# EAGLE design 1.0 - First design (EAGLE 6.4)
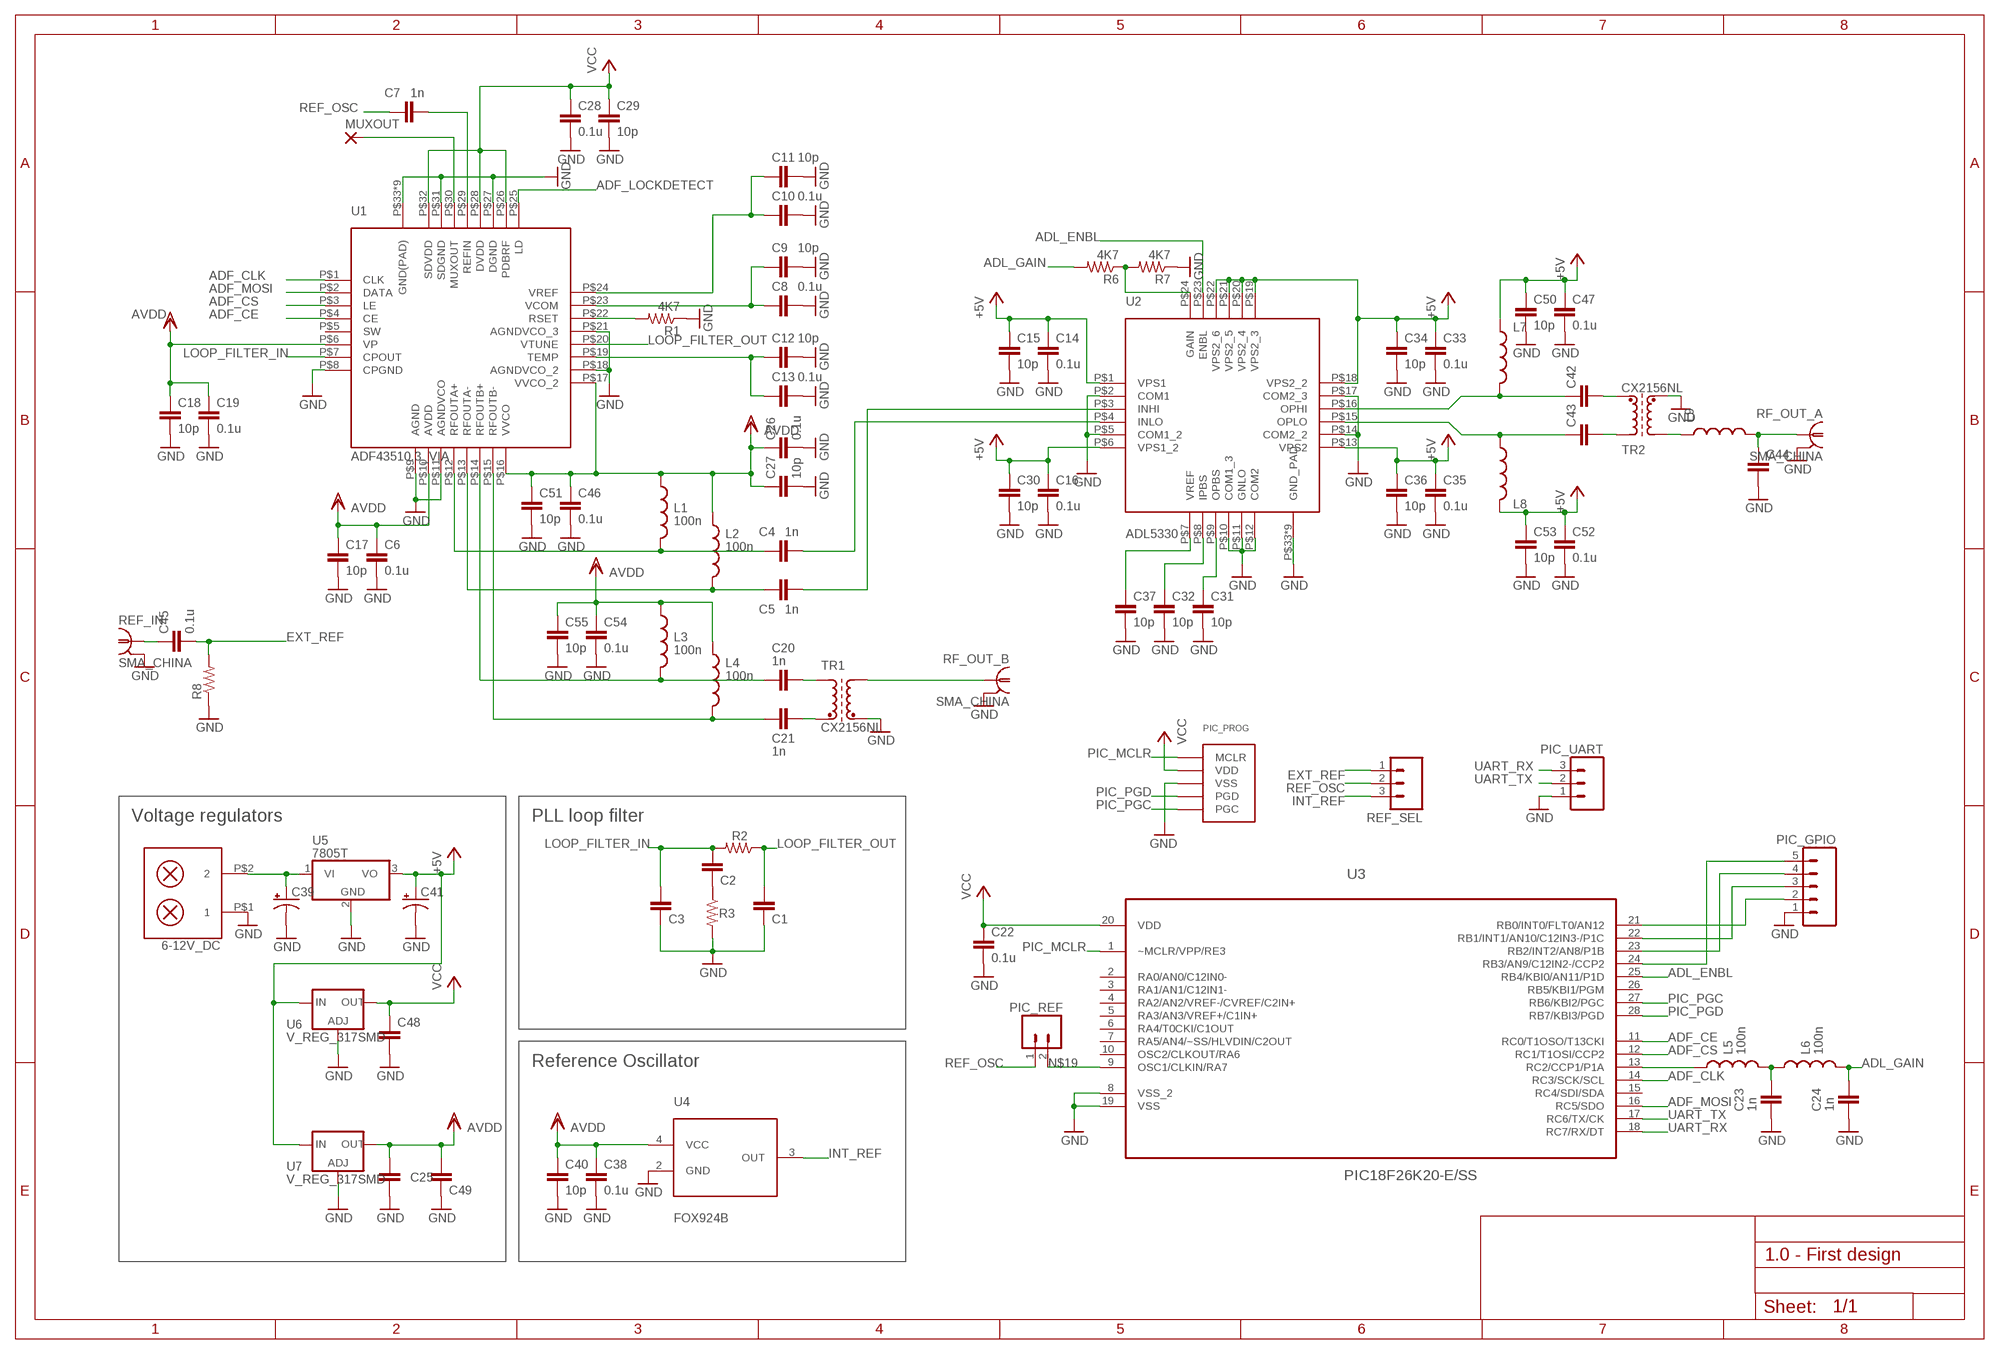
[diagram p0: schematic, sheet 1]

## Parts
6-12V_DC  PK5602  [PK5602]
C1  CAP0603-CAP  [0603-CAP]
C2  CAP0603-CAP  [0603-CAP]
C3  CAP0603-CAP  [0603-CAP]
C4  1n  CAP0603-CAP  [0603-CAP]
C5  1n  CAP0603-CAP  [0603-CAP]
C6  0.1u  CAP0603-CAP  [0603-CAP]
C7  1n  CAP0603-CAP  [0603-CAP]
C8  0.1u  CAP0603-CAP  [0603-CAP]
C9  10p  CAP0603-CAP  [0603-CAP]
C10  0.1u  CAP0603-CAP  [0603-CAP]
C11  10p  CAP0603-CAP  [0603-CAP]
C12  10p  CAP0603-CAP  [0603-CAP]
C13  0.1u  CAP0603-CAP  [0603-CAP]
C14  0.1u  CAP0603-CAP  [0603-CAP]
C15  10p  CAP0603-CAP  [0603-CAP]
C16  0.1u  CAP0603-CAP  [0603-CAP]
C17  10p  CAP0603-CAP  [0603-CAP]
C18  10p  CAP0603-CAP  [0603-CAP]
C19  0.1u  CAP0603-CAP  [0603-CAP]
C20  1n  CAP0603-CAP  [0603-CAP]
C21  1n  CAP0603-CAP  [0603-CAP]
C22  0.1u  CAP0603-CAP  [0603-CAP]
C23  1n  CAP0603-CAP  [0603-CAP]
C24  1n  CAP0603-CAP  [0603-CAP]
C25  C-EUC0805  [C0805]
C26  0.1u  CAP0603-CAP  [0603-CAP]
C27  10p  CAP0603-CAP  [0603-CAP]
C28  0.1u  CAP0603-CAP  [0603-CAP]
C29  10p  CAP0603-CAP  [0603-CAP]
C30  10p  CAP0603-CAP  [0603-CAP]
C31  10p  CAP0603-CAP  [0603-CAP]
C32  10p  CAP0603-CAP  [0603-CAP]
C33  0.1u  CAP0603-CAP  [0603-CAP]
C34  10p  CAP0603-CAP  [0603-CAP]
C35  0.1u  CAP0603-CAP  [0603-CAP]
C36  10p  CAP0603-CAP  [0603-CAP]
C37  10p  CAP0603-CAP  [0603-CAP]
C38  0.1u  CAP0603-CAP  [0603-CAP]
C39  CAP_POLSMD  [VISHAY_C]
C40  10p  CAP0603-CAP  [0603-CAP]
C41  CAP_POLSMD  [VISHAY_C]
C42  CAP  [C0805K]
C43  CAP  [C0805K]
C44  CAP  [C0805K]
C45  0.1u  CAP0603-CAP  [0603-CAP]
C46  0.1u  CAP0603-CAP  [0603-CAP]
C47  0.1u  CAP0603-CAP  [0603-CAP]
C48  C-EUC0805  [C0805]
C49  C-EUC0805  [C0805]
C50  10p  CAP0603-CAP  [0603-CAP]
C51  10p  CAP0603-CAP  [0603-CAP]
C52  0.1u  CAP0603-CAP  [0603-CAP]
C53  10p  CAP0603-CAP  [0603-CAP]
C54  0.1u  CAP0603-CAP  [0603-CAP]
C55  10p  CAP0603-CAP  [0603-CAP]
L1  100n  INDUCTOR0603  [0603]
L2  100n  INDUCTOR0603  [0603]
L3  100n  INDUCTOR0603  [0603]
L4  100n  INDUCTOR0603  [0603]
L5  100n  INDUCTOR0603  [0603]
L6  100n  INDUCTOR0603  [0603]
L7  INDUCTOR  [C0805K]
L8  INDUCTOR  [C0805K]
L9  INDUCTOR  [C0805K]
MUXOUT  SMD2  [SMD1,27-2,54]
PIC_GPIO  M05PTH  [1X05]
PIC_PROG  1X5_ICSP  [1X5_2MM]
PIC_REF  M02PTH  [1X02]
PIC_UART  M03PTH  [1X03]
R1  4K7  RESISTOR0603-RES  [0603-RES]
R2  RESISTOR0603-RES  [0603-RES]
R3  RESISTOR0603-RES  [0603-RES]
R6  4K7  RESISTOR0603-RES  [0603-RES]
R7  4K7  RESISTOR0603-RES  [0603-RES]
R8  RESISTOR  [C0805K]
REF_IN  SMA_CHINA  [SMA-EDGE]
REF_SEL  M03PTH  [1X03]
RF_OUT_A  SMA_CHINA  [SMA-EDGE]
RF_OUT_B  SMA_CHINA  [SMA-EDGE]
TR1  CX2156NL  [CX2156NL]
TR2  CX2156NL  [CX2156NL]
U1  ADF43510.3_VIA  [LFCSP_CP-32-2_.3VIA]
U2  ADL5330  [LFCSP_CP-24-2_.3VIA]
U3  PIC18F26K20-E/SS  [SOP65P780X200-28N]
U4  FOX924B  [FOX924B]
U5  7805T  [TO220H]
U6  V_REG_317SMD  [SOT223]
U7  V_REG_317SMD  [SOT223]

## Nets
+5V: C14.1 C15.1 C16.1 C30.1 C33.1 C34.1 C35.1 C36.1 C41.+ C47.1 C50.1 C52.1 C53.1 L7.1 L8.1 U2.P$1(VPS1) U2.P$6(VPS1_2) U2.P$13(VPS2) U2.P$18(VPS2_2) U2.P$19(VPS2_3) U2.P$20(VPS2_4) U2.P$21(VPS2_5) U2.P$22(VPS2_6) U5.3(VO) U6.3(IN) U7.3(IN)
ADF_CE: U1.P$4(CE) U3.11(RC0/T1OSO/T13CKI)
ADF_CLK: U1.P$1(CLK) U3.14(RC3/SCK/SCL)
ADF_CS: U1.P$3(LE) U3.12(RC1/T1OSI/CCP2)
ADF_LOCKDETECT: U1.P$25(LD)
ADF_MOSI: U1.P$2(DATA) U3.16(RC5/SDO)
ADF_MUXOUT: MUXOUT.1(P) U1.P$30(MUXOUT)
ADL_ENBL: U2.P$23(ENBL) U3.25(RB4/KBI0/AN11/P1D)
ADL_GAIN: C24.2 L6.2 R6.2
EXT_REF: C45.2 R8.2 REF_SEL.1
GND: 6-12V_DC.P$1 C1.2 C3.2 C6.2 C8.2 C9.2 C10.2 C11.2 C12.2 C13.2 C14.2 C15.2 C16.2 C17.2 C18.2 C19.2 C22.2 C23.1 C24.1 C25.2 C26.2 C27.2 C28.2 C29.2 C30.2 C31.2 C32.2 C33.2 C34.2 C35.2 C36.2 C37.2 C38.2 C39.- C40.2 C41.- C44.2 C46.2 C47.2 C48.2 C49.2 C50.2 C51.2 C52.2 C53.2 C54.2 C55.2 PIC_GPIO.1 PIC_PROG.P$3(VSS) PIC_UART.1 R1.1 R3.2 R7.1 R8.1 REF_IN.GND@0(GND) REF_IN.GND@1(GND) REF_IN.GND@2(GND) REF_IN.GND@3(GND) RF_OUT_A.GND@0(GND) RF_OUT_A.GND@1(GND) RF_OUT_A.GND@2(GND) RF_OUT_A.GND@3(GND) RF_OUT_B.GND@0(GND) RF_OUT_B.GND@1(GND) RF_OUT_B.GND@2(GND) RF_OUT_B.GND@3(GND) TR1.5(E2) TR2.5(E2) U1.P$8(CPGND) U1.P$9(AGND) U1.P$11(AGNDVCO) U1.P$18(AGNDVCO_2) U1.P$21(AGNDVCO_3) U1.P$27(DGND) U1.P$31(SDGND) U1.P$33(GND(PAD)) U1.P$34(GND(PAD)) U1.P$35(GND(PAD)) U1.P$36(GND(PAD)) U1.P$37(GND(PAD)) U1.P$38(GND(PAD)) U1.P$39(GND(PAD)) U1.P$40(GND(PAD)) U1.P$41(GND(PAD)) U2.P$2(COM1) U2.P$5(COM1_2) U2.P$10(COM1_3) U2.P$11(GNLO) U2.P$12(COM2) U2.P$14(COM2_2) U2.P$17(COM2_3) U2.P$33(GND_PAD) U2.P$34(GND_PAD) U2.P$35(GND_PAD) U2.P$36(GND_PAD) U2.P$37(GND_PAD) U2.P$38(GND_PAD) U2.P$39(GND_PAD) U2.P$40(GND_PAD) U2.P$41(GND_PAD) U3.8(VSS_2) U3.19(VSS) U4.2(GND) U5.2(GND) U6.1(ADJ) U7.1(ADJ)
INT_REF: REF_SEL.3 U4.3(OUT)
LOOP_FILTER_IN: C2.1 C3.1 R2.2 U1.P$7(CPOUT)
LOOP_FILTER_OUT: C1.1 R2.1 U1.P$20(VTUNE)
N$1: C5.2 U2.P$3(INHI)
N$2: C4.2 U2.P$4(INLO)
N$3: C7.2 U1.P$29(REFIN)
N$4: L9.1 TR2.4(A2)
N$5: C42.1 L7.2 U2.P$16(OPHI)
N$6: R1.2 U1.P$22(RSET)
N$7: C43.1 L8.2 U2.P$15(OPLO)
N$8: C2.2 R3.1
N$9: C5.1 L2.2 U1.P$13(RFOUTA-)
N$10: C4.1 L1.2 U1.P$12(RFOUTA+)
N$11: 6-12V_DC.P$2 C39.+ U5.1(VI)
N$12: C43.2 TR2.3(A1)
N$13: C12.1 C13.1 U1.P$19(TEMP)
N$14: C8.1 C9.1 U1.P$23(VCOM)
N$15: PIC_GPIO.5 U3.24(RB3/AN9/C12IN2-/CCP2)
N$16: C42.2 TR2.1(E1)
N$17: PIC_GPIO.4 U3.23(RB2/INT2/AN8/P1B)
N$18: C20.1 L3.2 U1.P$14(RFOUTB+)
N$19: PIC_REF.2 U3.9(OSC1/CLKIN/RA7)
N$20: C10.1 C11.1 U1.P$24(VREF)
N$21: C21.1 L4.2 U1.P$15(RFOUTB-)
N$22: L5.1 U3.13(RC2/CCP1/P1A)
N$23: C21.2 TR1.1(E1)
N$24: C23.2 L5.2 L6.1
N$25: C20.2 TR1.3(A1)
N$26: RF_OUT_B.SIG TR1.4(A2)
N$27: C37.1 U2.P$7(VREF)
N$28: PIC_GPIO.3 U3.22(RB1/INT1/AN10/C12IN3-/P1C)
N$29: PIC_GPIO.2 U3.21(RB0/INT0/FLT0/AN12)
N$31: R6.1 R7.2 U2.P$24(GAIN)
N$32: C45.1 REF_IN.SIG
N$37: C31.1 U2.P$9(OPBS)
N$38: C32.1 U2.P$8(IPBS)
N$40: C44.1 L9.2 RF_OUT_A.SIG
PIC_MCLR: PIC_PROG.P$1(MCLR) U3.1(~MCLR/VPP/RE3)
PIC_PGC: PIC_PROG.P$5(PGC) U3.27(RB6/KBI2/PGC)
PIC_PGD: PIC_PROG.P$4(PGD) U3.28(RB7/KBI3/PGD)
REF_OSC: C7.1 PIC_REF.1 REF_SEL.2
UART_RX: PIC_UART.3 U3.18(RC7/RX/DT)
UART_TX: PIC_UART.2 U3.17(RC6/TX/CK)
VCC: C22.1 C28.1 C29.1 C48.1 PIC_PROG.P$2(VDD) U1.P$26(PDBRF) U1.P$28(DVDD) U1.P$32(SDVDD) U3.20(VDD) U6.2(OUT)
VDD: C6.1 C17.1 C18.1 C19.1 C25.1 C26.1 C27.1 C38.1 C40.1 C46.1 C49.1 C51.1 C54.1 C55.1 L1.1 L2.1 L3.1 L4.1 U1.P$6(VP) U1.P$10(AVDD) U1.P$16(VVCO) U1.P$17(VVCO_2) U4.4(VCC) U7.2(OUT) ; supply symbol labelled AVDD
Unconnected: U1.P$5(SW) U3.2(RA0/AN0/C12IN0-) U3.3(RA1/AN1/C12IN1-) U3.4(RA2/AN2/VREF-/CVREF/C2IN+) U3.5(RA3/AN3/VREF+/C1IN+) U3.6(RA4/T0CKI/C1OUT) U3.7(RA5/AN4/~SS/HLVDIN/C2OUT) U3.10(OSC2/CLKOUT/RA6) U3.15(RC4/SDI/SDA) U3.26(RB5/KBI1/PGM)

## Notes on the sheet
- Voltage regulators | PLL loop filter
- Reference Oscillator

## Library data of the parts
6-12V_DC = 08-maritime-components:PK5602: Screw terminal from Hartmann ELFA: https://www.elfaelektronikk.no/elfa3~no_no/elfa/init.do?item=48-335-80&toc=19604
C1-C24 C26-C38 C40 C45-C47 C50-C55 = SparkFun:CAP: Capacitor Standard 0603 ceramic capacitor, and 0.1" leaded capacitor.
C25 C48 C49 = rcl:C-EU: CAPACITOR, European symbol
C39 C41 = SparkFun:CAP_POL: Capacitor Polarized These are standard SMD and PTH capacitors. Normally 10uF, 47uF, and 100uF in electrolytic and tantalum varieties. Always verify the external diameter of the through hole cap, it varies with capacity, voltage, and manufacturer. The EIA devices should be standard.
C42-C44 = 03-vhf_sdr:CAP: Capacitor Standard 0603 ceramic capacitor, and 0.1" leaded capacitor.
L1-L6 = SparkFun:INDUCTOR: Inductors Basic Inductor/Choke - 0603 and 1206. Footprints are not proven and vary greatly between part numbers.
L7-L9 = 03-vhf_sdr:INDUCTOR: Inductors Basic Inductor/Choke - 0603 and 1206. Footprints are not proven and vary greatly between part numbers.
MUXOUT = wirepad:SMD2: SMD PAD
PIC_GPIO = SparkFun:M05: Header 5 Standard 5-pin 0.1" header. Use with straight break away headers (SKU : PRT-00116), right angle break away headers (PRT-00553), swiss pins (PRT-00743), machine pins (PRT-00117), and female headers (PRT-00115). Molex polarized connector foot print use with SKU : PRT-08230 with associated crimp pins and housings.
PIC_PROG = 01-eos-components:1X5_ICSP
PIC_REF = SparkFun:M02: Header 2 Standard 2-pin 0.1" header. Use with straight break away headers (SKU : PRT-00116), right angle break away headers (PRT-00553), swiss pins (PRT-00743), machine pins (PRT-00117), and female headers (PRT-00115). Molex polarized connector foot print use with SKU : PRT-08233 with associated crimp pins and housings.
PIC_UART REF_SEL = SparkFun:M03: Header 3 Standard 3-pin 0.1" header. Use with straight break away headers (SKU : PRT-00116), right angle break away headers (PRT-00553), swiss pins (PRT-00743), machine pins (PRT-00117), and female headers (PRT-00115). Molex polarized connector foot print use with SKU : PRT-08232 with associated crimp pins and housings.
R1-R3 R6 R7 = SparkFun:RESISTOR: Resistor Basic schematic elements and footprints for 0603, 1206, and PTH 1/10th watt (small) resistors.
R8 = 03-vhf_sdr:RESISTOR: Resistor Basic schematic elements and footprints for 0603, 1206, and PTH 1/10th watt (small) resistors.
REF_IN RF_OUT_A RF_OUT_B = 03-vhf_sdr:SMA_CHINA
TR1 TR2 = 03-vhf_sdr:CX2156NL
U1 = 03-vhf_sdr:ADF4351
U2 = 03-vhf_sdr:ADL5330
U3 = 01-eos-components:PIC18F26K20-E/SS: Flash Microcontrollers; MPN: PIC18F26K20-E/SS; OC_FARNELL: 1664860; OC_NEWARK: 88K6003; PACKAGE: SSOP-28; SUPPLIER: Microchip
U4 = 03-vhf_sdr:FOX924B
U5 = linear:78*: Positive VOLTAGE REGULATOR Source: http://cache.national.com/ds/LM/LM78L05.pdf http://www.fairchildsemi.com/ds/LM/LM7805.pdf
U6 U7 = SparkFun:V_REG_317: Voltage Regulator Standard LM317 adjustable voltage regulator. AOI (Adjust Output Input). Google 'LM317 Calculator' for easy to use app to get the two resistor values needed. 240/720 for 5V output. 240/390 for 3.3V output. Spark Fun Electronics SKU : COM-00527

## Board
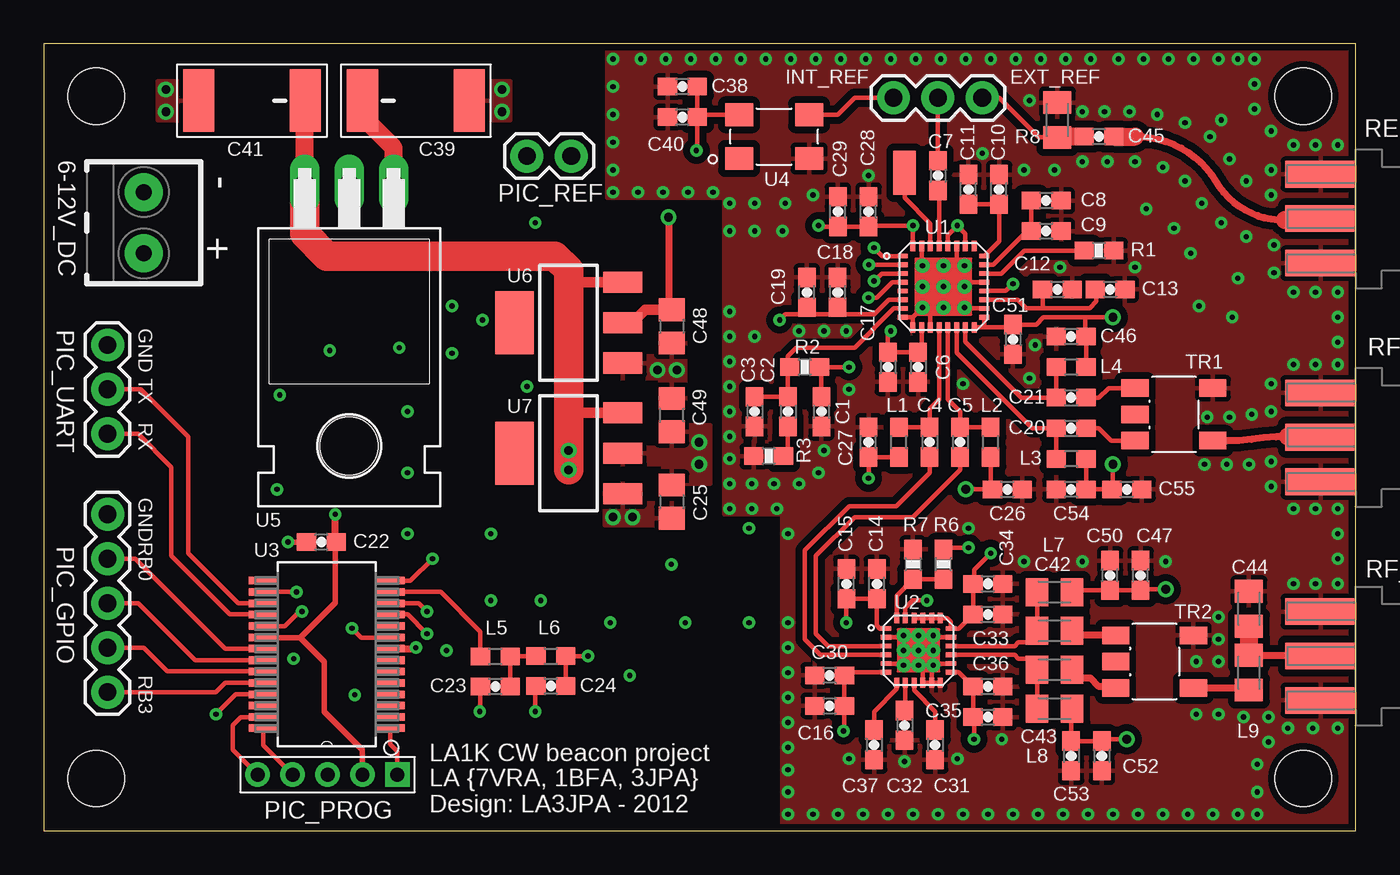
[diagram p1: board, top side]
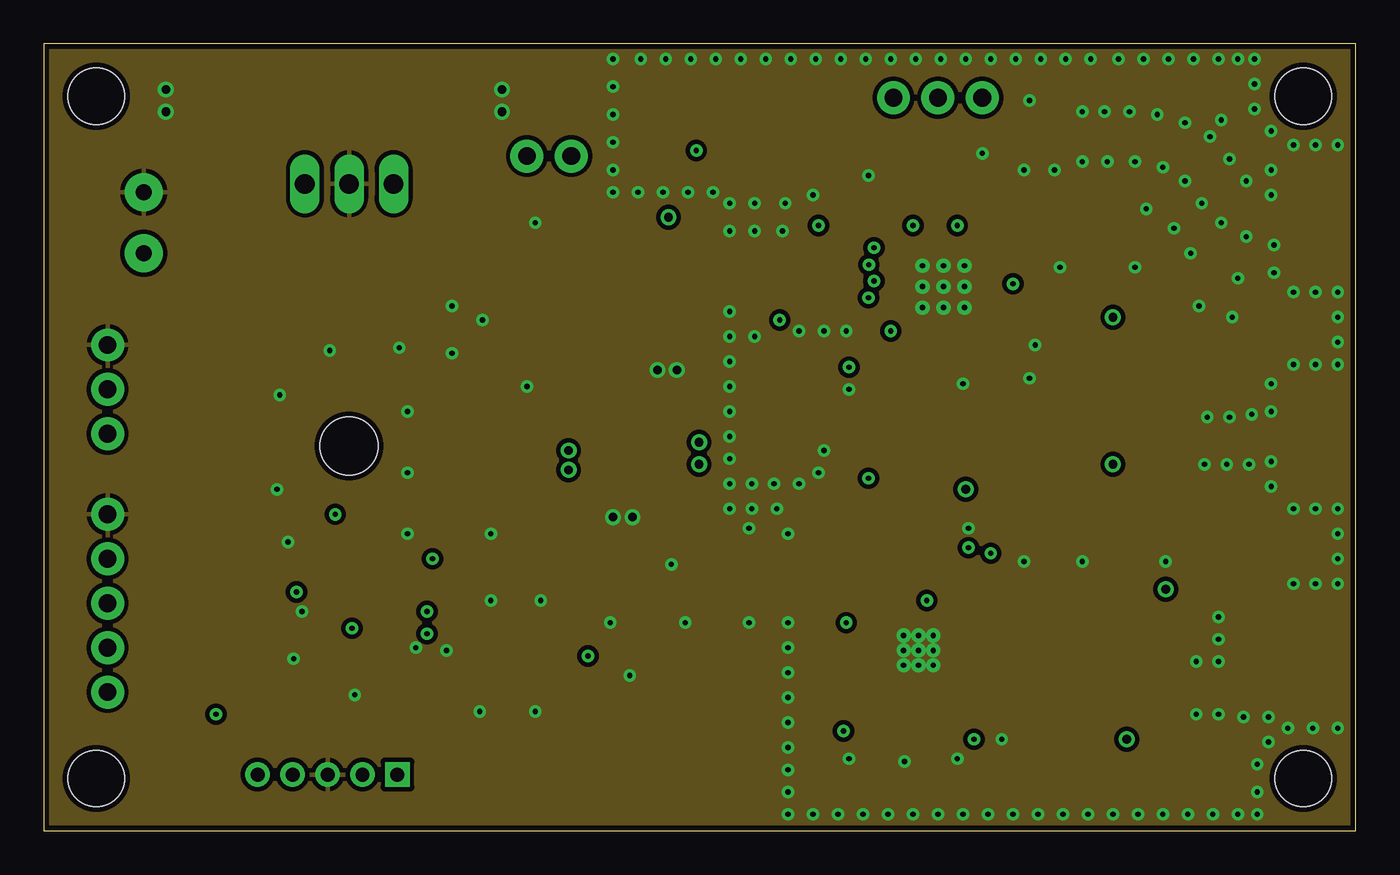
[diagram p2: board, inner layer Route2]
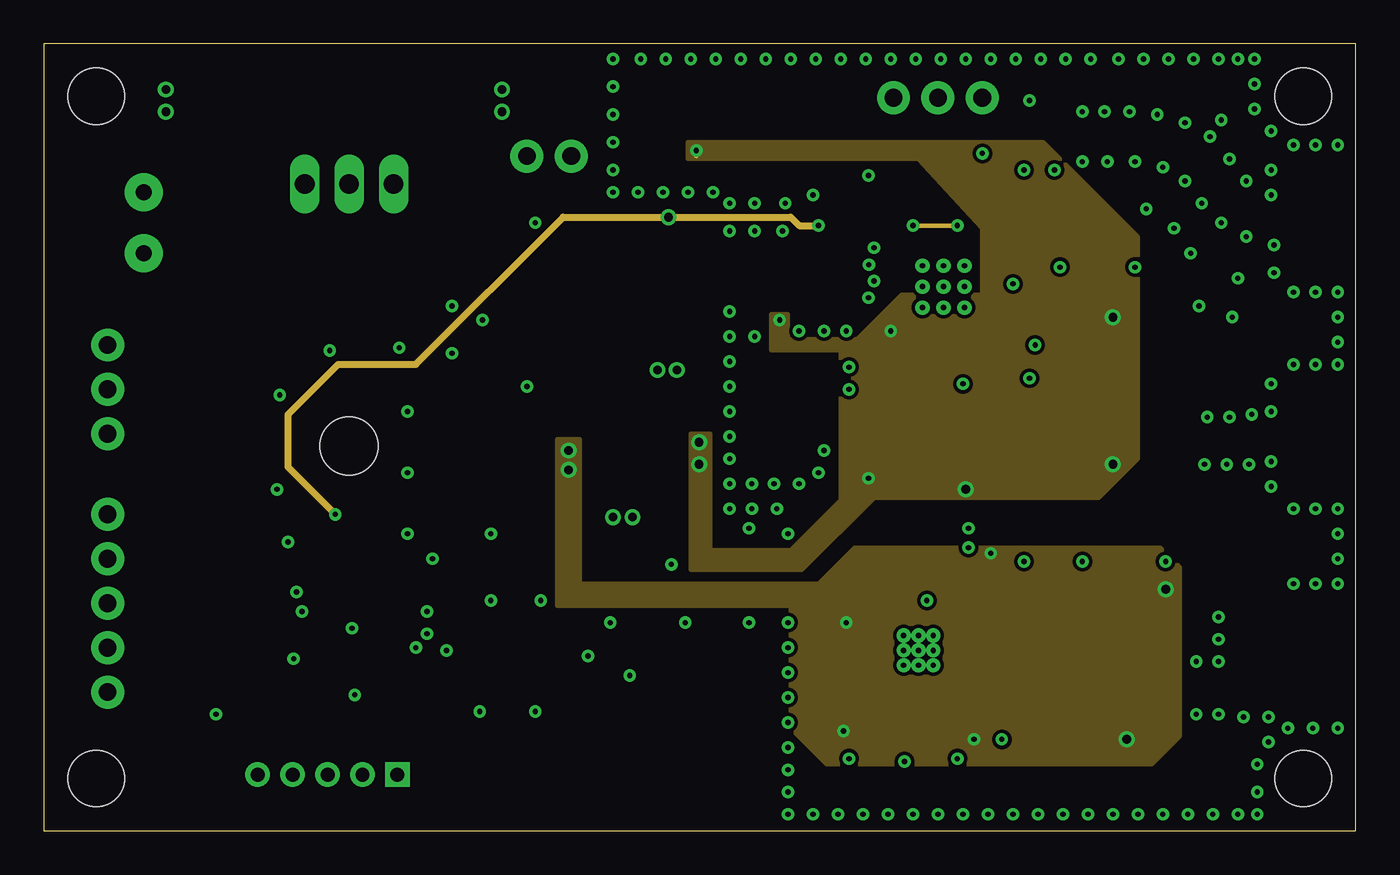
[diagram p3: board, inner layer Route3]
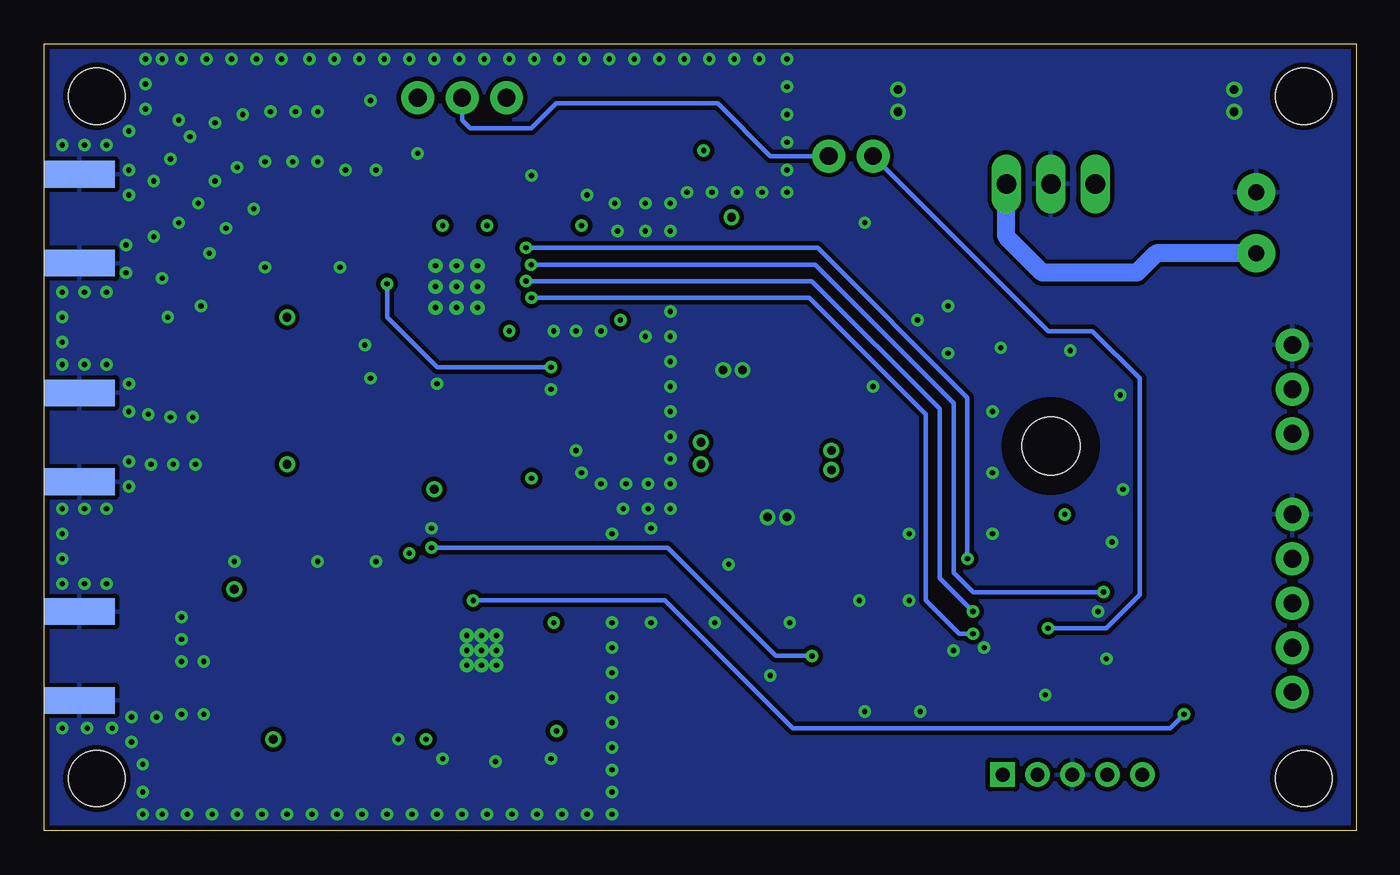
[diagram p4: board, bottom side, seen from below]

Size 75 x 45 mm. Coordinates in mm from the lower left corner, seen from the top.
Outline: 0,0 75,0 75,45 0,45 0,0
Copper layers (1+2*3+16): Top 0.035mm / dielectric 0.2mm / Route2 0.035mm / dielectric 1.2mm / Route3 0.035mm / dielectric 0.2mm / Bottom 0.035mm
Design rules: minimum track width 10mil, minimum drill 24mil, track to track 8mil, track to pad 8mil, pad to pad 8mil, via to via 8mil, smd to smd 8mil, copper to edge 12mil, drill to drill 8mil, minimum pad ring 10mil, minimum via ring 8mil, stop-mask expansion 4mil, vias tented up to drill 20mm, thermal gap 10mil
Holes 3.2 mm at 3,3 3,42 72,42 72,3

### Footprints (pad centres in the part's own frame; a part is rotated, then mirrored left to right if it is on the bottom)
PK5602 = drill 0.9 pad 2.184: P$1 -1.75,0; P$2 1.75,0
0603-CAP = smd 1.1 x 1: 1 -0.85,0; 2 0.85,0
C0805 = smd 1.3 x 1.5: 1 -0.95,0; 2 0.95,0
VISHAY_C = smd 3.556 x 1.778: + 0,3.048; - 0,-3.048
C0805K = smd 1.3 x 1.6: 1 -1,0; 2 1,0
0603 = smd 1.1 x 1: 1 -0.85,0; 2 0.85,0
SMD1,27-2,54 = smd 1.27 x 2.54: 1 0,0
1X05 = drill 1.016 pad 1.88: 1 0,0; 2 2.54,0; 3 5.08,0; 4 7.62,0; 5 10.16,0
1X5_2MM = drill 0.8 pad 1.422 square: P$1 -4,0 | drill 0.8 pad 1.422: P$2 -2,0; P$3 0,0; P$4 2,0; P$5 4,0
1X02 = drill 1.016 pad 1.88: 1 0,0; 2 2.54,0
1X03 = drill 1.016 pad 1.88: 1 0,0; 2 2.54,0; 3 5.08,0
0603-RES = smd 1.1 x 1: 1 -0.85,0; 2 0.85,0
SMA-EDGE = smd 1.524 x 4.064: GND@0 -2.54,0; GND@1 2.54,0; SIG 0,0 | smd 1.524 x 4.064 bottom: GND@2 -2.54,0; GND@3 2.54,0
CX2156NL = smd 1 x 1.55: 1 -1.5,-2.225; 2 0,-2.225; 3 1.5,-2.225; 4 1.5,2.225; 5 -1.5,2.225
LFCSP_CP-32-2_.3VIA = smd 0.59 x 0.28: P$1 -2.33,1.75; P$2 -2.33,1.25; P$3 -2.33,0.75; P$4 -2.33,0.25; P$5 -2.33,-0.25; P$6 -2.33,-0.75; P$7 -2.33,-1.25; P$8 -2.33,-1.75; P$17 2.33,-1.75; P$18 2.33,-1.25; P$19 2.33,-0.75; P$20 2.33,-0.25; P$21 2.33,0.25; P$22 2.33,0.75; P$23 2.33,1.25; P$24 2.33,1.75 | smd 0.28 x 0.59: P$9 -1.75,-2.33; P$10 -1.25,-2.33; P$11 -0.75,-2.33; P$12 -0.25,-2.33; P$13 0.25,-2.33; P$14 0.75,-2.33; P$15 1.25,-2.33; P$16 1.75,-2.33; P$25 1.75,2.33; P$26 1.25,2.33; P$27 0.75,2.33; P$28 0.25,2.33; P$29 -0.25,2.33; P$30 -0.75,2.33; P$31 -1.25,2.33; P$32 -1.75,2.33 | drill 0.3: P$33 0,1.2; P$34 -1.2,0; P$35 1.2,0; P$36 -1.2,1.2; P$37 0,-1.2; P$38 1.2,1.2; P$39 0,0; P$40 -1.2,-1.2; P$41 1.2,-1.2
LFCSP_CP-24-2_.3VIA = smd 0.59 x 0.28: P$1 -1.85,1.25; P$2 -1.85,0.75; P$3 -1.85,0.25; P$4 -1.85,-0.25; P$5 -1.85,-0.75; P$6 -1.85,-1.25; P$13 1.85,-1.25; P$14 1.85,-0.75; P$15 1.85,-0.25; P$16 1.85,0.25; P$17 1.85,0.75; P$18 1.85,1.25 | smd 0.28 x 0.59: P$7 -1.25,-1.85; P$8 -0.75,-1.85; P$9 -0.25,-1.85; P$10 0.25,-1.85; P$11 0.75,-1.85; P$12 1.25,-1.85; P$19 1.25,1.85; P$20 0.75,1.85; P$21 0.25,1.85; P$22 -0.25,1.85; P$23 -0.75,1.85; P$24 -1.25,1.85 | drill 0.3: P$33 0,0.85; P$34 -0.85,0; P$35 0.85,0; P$36 -0.85,0.85; P$37 0,-0.85; P$38 0.85,0.85; P$39 0,0; P$40 -0.85,-0.85; P$41 0.85,-0.85
SOP65P780X200-28N = smd 1.651 x 0.432: 1 -3.632,4.216; 2 -3.632,3.581; 3 -3.632,2.921; 4 -3.632,2.286; 5 -3.632,1.626; 6 -3.632,0.965; 7 -3.632,0.33; 8 -3.632,-0.33; 9 -3.632,-0.965; 10 -3.632,-1.626; 11 -3.632,-2.286; 12 -3.632,-2.921; 13 -3.632,-3.581; 14 -3.632,-4.216; 15 3.632,-4.216; 16 3.632,-3.581; 17 3.632,-2.921; 18 3.632,-2.286; 19 3.632,-1.626; 20 3.632,-0.965; 21 3.632,-0.33; 22 3.632,0.33; 23 3.632,0.965; 24 3.632,1.626; 25 3.632,2.286; 26 3.632,2.921; 27 3.632,3.581; 28 3.632,4.216
FOX924B = smd 1.6 x 1.3: 1 -2,-1.25; 2 2,-1.25; 3 2,1.25; 4 -2,1.25
TO220H = drill 1.118 long: 1 -2.54,-10.16; 2 0,-10.16; 3 2.54,-10.16 | hole 3.302: 0,4.826
SOT223 = smd 1.219 x 2.235: 1 -2.311,-3.099; 2 0,-3.099; 3 2.311,-3.099 | smd 3.6 x 2.2: 4 0,3.099

### Placement (x,y rotation side)
6-12V_DC  5.71,34.77 270 top
C1  44.45,23.97 270 top
C2  42.55,23.97 270 top
C3  40.64,23.97 270 top
C4  50.64,22.23 270 top
C5  52.39,22.23 270 top
C6  49.99,26.52 270 top
C7  51.12,37.47 270 top
C8  57.31,36.04 0 top
C9  57.31,34.29 0 top
C10  54.61,36.67 90 top
C11  52.86,36.67 90 top
C12  57.94,30.96 0 top
C13  60.96,30.96 0 top
C14  47.62,14.13 90 top
C15  45.88,14.13 90 top
C16  44.93,7.14 180 top
C17  48.26,26.52 270 top
C18  45.39,30.79 90 top
C19  43.63,30.79 90 top
C20  58.74,23.02 0 top
C21  58.74,24.77 0 top
C22  15.88,16.51 180 top
C23  25.82,8.26 0 top
C24  28.99,8.28 0 top
C25  35.9,18.82 270 top
C26  55.09,19.53 0 top
C27  47.15,22.23 90 top
C28  47.15,35.4 90 top
C29  45.4,35.4 90 top
C30  44.93,8.89 180 top
C31  50.96,4.92 270 top
C32  49.21,6.03 270 top
C33  53.98,12.38 0 top
C34  53.98,14.13 0 top
C35  53.98,6.51 0 top
C36  53.98,8.26 0 top
C37  47.47,4.92 270 top
C38  36.51,42.55 180 top
C39  21.27,41.75 90 top
C40  36.51,40.8 180 top
C41  11.91,41.75 270 top
C42  57.78,11.43 0 top
C43  57.78,9.21 0 top
C44  68.9,12.7 90 top
C45  60.33,39.69 180 top
C46  58.74,28.26 180 top
C47  62.71,14.61 90 top
C48  35.9,28.84 270 top
C49  35.9,23.77 90 top
C50  60.96,14.61 90 top
C51  55.4,28.1 270 top
C52  60.48,4.29 270 top
C53  58.74,4.29 270 top
C54  58.74,19.53 180 top
C55  61.91,19.53 0 top
L1  48.9,22.23 90 top
L2  54.13,22.23 90 top
L3  58.74,21.27 180 top
L4  58.74,26.51 180 top
L5  25.82,9.97 0 top
L6  28.99,9.99 0 top
L7  57.78,13.65 180 top
L8  57.78,6.99 180 top
L9  68.9,9.05 90 top
MUXOUT  49.21,37.62 0 top
PIC_GPIO  3.65,18.1 270 top
PIC_PROG  16.22,3.22 180 top
PIC_REF  30.16,38.58 180 top
PIC_UART  3.65,27.78 270 top
R1  60.33,33.18 180 top
R2  43.5,26.51 180 top
R3  41.43,21.43 180 top
R6  51.44,15.24 90 top
R7  49.69,15.24 270 top
R8  57.94,40.64 270 top
REF_IN  73,35 270 top
REF_SEL  53.66,41.91 180 top
RF_OUT_A  73,10 270 top
RF_OUT_B  73,22.5 270 top
TR1  64.61,23.81 270 top
TR2  63.5,9.68 270 top
U1  51.44,31.11 0 top
U2  50.01,10.32 0 top
U3  16.18,10.09 180 top
U4  41.75,39.69 0 top
U5  17.46,26.83 180 top
U6  30,29.05 90 top
U7  30,21.59 90 top

### Tracks (layer width: path | path; a pad name or v marks a point on that pad's centre or on a via)
+5V  (via drill 0.3, 0.5)
  Top 0.254: U2.P$13 52.31,9.07 C36.1 C35.1 53.18,6.45 v53.18,5.24 | U2.P$22 U2.P$21 U2.P$20 U2.P$19 51.65,12.17 51.86,11.96 U2.P$18 52.31,11.57 C33.1 C34.1 53.18,14.19 53.18,14.92 v54.13,15.88 | U2.P$1 47.8,11.57 47.62,11.75 C14.1 C15.1 v45.88,11.91 | U2.P$6 46.06,9.07 46.04,9.05 45.94,8.73 C30.1 C16.1 45.78,5.71 v45.72,5.71 | 58.89,13.76 C50.1 C47.1 62.76,13.81 v64.14,13.81 | L8.1 58.74,6.94 C53.1 C52.1 60.59,5.24 v61.91,5.24
  Top 0.406: 30,23.9 v30,21.75 | 30,31.36 30,31.59
  Top 0.61: 58.89,13.76 L7.1 | U7.3 30,23.9 | U6.3 30,31.36
  Top 1.016: U5.3 14.92,41.72 C41.+
  Top 1.676: U5.3 14.92,34.13 16.19,32.86 29.21,32.86 30,32.07 30,31.59 v30,21.75 v30,20.64
  pour Route3: 30.64,14.13 44.29,14.13 46.35,16.19 63.82,16.19 64.93,15.08 64.93,5.4 63.34,3.81 44.77,3.81 42.7,5.87 42.7,12.86 29.37,12.86 29.37,22.38 30.64,22.38
ADF_CE  (via drill 0.3)
  Top 0.254: U3.11 20.8,12.37 v21.91,11.27 | v47.15,30.48 47.62,30.48 48.51,31.36 U1.P$4
  Bottom 0.254: v21.91,11.27 22.7,11.27 24.61,13.18 24.61,23.81 31.27,30.48 v47.15,30.48
ADF_CLK  (via drill 0.3)
  Top 0.254: U1.P$1 47.94,32.87 v47.47,33.34 | v22.23,15.56 20.95,14.29 19.83,14.29 U3.14
  Bottom 0.254: v47.47,33.34 30.8,33.34 22.23,24.77 v22.23,15.56
ADF_CS  (via drill 0.3)
  Top 0.254: U1.P$3 47.9,31.86 v47.47,31.43 | v21.91,12.54 21.43,13.02 U3.12
  Bottom 0.254: v47.47,31.43 31.11,31.43 23.81,24.13 23.81,14.45 v21.91,12.54
ADF_MOSI  (via drill 0.3)
  Top 0.254: U1.P$2 v47.17,32.37 | v14.45,13.65 14.46,13.67 U3.16
  Bottom 0.254: v47.17,32.37 30.94,32.37 23.02,24.45 23.02,14.76 21.91,13.65 v14.45,13.65
ADF_MUXOUT
  Top 0.254: U1.P$30 50.69,34.72 49.21,36.2 MUXOUT.1
ADL_ENBL  (via drill 0.3)
  Top 0.254: U2.P$23 49.26,12.74 49.69,13.18 v50.48,13.18 | U3.25 10.98,7.8 v9.84,6.67
  Bottom 0.254: v50.48,13.18 39.53,13.18 32.23,5.87 10.64,5.87 v9.84,6.67
ADL_GAIN  (via drill 0.3)
  Top 0.254: C24.2 L6.2 30.94,9.99 v31.11,10 | v52.86,16.19 51.44,16.19 R6.2
  Bottom 0.254: v31.11,10 33.18,10 39.13,15.95 39.21,16.03 39.37,16.19 v52.86,16.19
EXT_REF
  Top 0.254: R8.2 56.88,39.64 54.61,41.91 REF_SEL.1
  Top 1.016: C45.2 57.9,39.69 R8.2
GND  (via drill 0.3, 0.5)
  Top 0.254: U1.P$11 50.69,30.36 50.74,30.5 | 50.74,30.5 U1.P$33 | U1.P$9 49.69,29.36 | U1.P$8 49.69,29.36 | U1.P$21 52.88,31.36 U1.P$35 U1.P$38 | U1.P$18 52.69,29.86 U1.P$41 U1.P$37 | U1.P$27 52.19,32.31 U1.P$38 | U1.P$31 50.19,32.31 U1.P$36 U1.P$33 | 49.69,29.36 U1.P$40 | U1.P$38 U1.P$33 | U1.P$34 U1.P$40 | U1.P$40 U1.P$37 | U1.P$37 U1.P$39 | U1.P$40 50.23,30 50.74,30.5 | U2.P$11 U2.P$10 50.26,9.22 U2.P$37 U2.P$40 | U2.P$11 U2.P$12 | U2.P$11 50.76,9.37 U2.P$41 | U2.P$14 50.96,9.57 U2.P$41 | U2.P$5 49.06,9.57 U2.P$40 | U2.P$2 49.06,11.07 U2.P$36 | U2.P$17 50.96,11.07 U2.P$38 U2.P$33 | U2.P$40 U2.P$34 U2.P$36 | U2.P$36 U2.P$33 | U2.P$33 U2.P$39 | U2.P$35 U2.P$41 | U3.19 13.78,11.71 14.61,12.54 v14.76,12.54 | C23.1 24.97,6.87 v24.92,6.83 | v28.1,6.83 28.1,8.23 C24.1
  Top 0.305: C22.2 v13.97,16.51
  Top 0.406: U3.8 21.33,10.42 v21.27,10.48
  Top 1.016: C41.- 8.86,42.58 8.73,42.7
  other vias: 56.04,37.78 63.02,35.56 52.55,25.56 32.54,42.55 47.15,37.47 39.21,22.54 39.21,23.97 44.61,21.75 73.98,26.67 72.71,26.67 71.44,26.67 73.98,27.94 73.98,39.21 72.71,39.21 71.44,39.21 68.74,37.15 73.98,30.8 72.71,30.8 71.44,30.8 73.98,29.37 70.17,36.35 64.61,34.45 67.31,40.64 70.17,23.97 60.64,41.12 62.07,41.12 67.79,38.42 66.67,39.69 65.25,40.48 70.17,25.56 63.66,40.96 67.15,9.68 70.17,37.78 70.33,33.5 67.15,6.67 68.26,31.59 68.58,6.51 65.88,6.67 68.74,33.97 70.33,31.91 67.31,34.77 66.2,35.88 65.25,37.15 63.98,37.94 62.39,38.26 60.8,38.26 59.37,38.26 66.52,23.65 70.17,19.68 68.9,20.95 70.01,6.51 66.36,20.95 57.78,37.78 65.56,33.02 62.39,32.23 67.94,29.37 66.04,30 67.63,20.95 52.86,17.3 42.55,6.19 42.55,9.05 46.04,4.13 52.23,4.13 49.21,3.97 54.77,5.24 73.98,5.87 72.55,5.87 73.98,16.99 71.12,5.87 14.29,9.84 17.78,7.78 73.98,18.41 72.71,18.41 71.44,18.41 67.15,10.95 73.98,14.13 72.71,14.13 71.44,14.13 73.98,15.56 67.15,12.22 70.17,21.11 67.79,23.65 69.06,23.81 39.21,26.83 39.21,28.26 39.21,25.4 39.21,21.27 36.67,11.91 42.55,16.99 32.38,11.91 39.21,19.84 45.88,28.57 44.61,28.57 41.91,18.41 39.21,18.41 40.48,18.41 6.99,42.39 6.99,41.12 26.19,41.12 26.19,42.39 43.97,0.95 45.4,0.95 46.83,0.95 48.26,0.95 49.69,0.95 51.12,0.95 52.55,0.95 53.98,0.95 55.4,0.95 56.83,0.95 58.26,0.95 59.69,0.95 61.12,0.95 62.55,0.95 63.98,0.95 65.41,0.95 66.83,0.95 68.26,0.95 69.37,0.95 69.37,2.22 69.37,3.81 70.01,5.08 42.55,0.95 42.55,4.76 42.55,2.22 42.55,3.49 42.55,7.62 28.42,13.18 35.88,15.24 42.55,10.48 42.55,11.91 35.08,26.35 32.54,17.94 33.66,17.94 36.2,26.35 33.5,8.89 40.64,35.88 42.39,35.88 41.27,44.13 42.7,44.13 44.13,44.13 45.56,44.13 46.99,44.13 48.42,44.13 49.85,44.13 51.28,44.13 52.7,44.13 54.13,44.13 55.56,44.13 56.99,44.13 58.42,44.13 59.85,44.13 34.13,44.13 35.56,44.13 36.99,44.13 38.42,44.13 39.85,44.13 32.54,44.13 56.36,41.75 59.37,41.12 61.44,44.13 62.87,44.13 64.29,44.13 65.72,44.13 67.15,44.13 68.26,44.13 69.22,44.13 69.22,42.7 69.22,41.27 70.17,40.01 43.18,28.57 40.64,28.26 20.8,16.99 13.49,24.92 20.8,20.48 20.8,23.97 23.34,27.3 25.08,29.21 13.34,19.53 16.35,27.46 20.32,27.62 23.34,30 28.1,34.77 23.02,10.32 25.56,13.18 25.56,16.99 27.62,25.4 53.66,38.73 43.97,36.35 39.21,29.69 39.21,34.29 39.21,35.88 38.26,36.51 36.83,36.51 35.4,36.51 33.97,36.51 32.54,36.51 32.54,37.78 32.54,39.37 32.54,40.96 58.1,32.23 65.88,9.68 56.36,25.88 56.67,27.78 46.04,25.24 40.48,19.84 41.75,19.84 43.18,19.84 44.29,20.48 64.14,15.4 59.37,15.4 56.04,15.4 40.64,34.29 42.23,34.29 40.32,17.3 40.32,11.91
  pour Route2 (isolate 0.254): -0.32,-0.48 75.56,-0.48 75.56,45.4 -0.32,45.4
  pour Bottom (isolate 0.254): -0.64,-0.95 76.04,-0.95 76.04,45.88 -0.64,45.88
  pour Top: 8.89,42.86 6.51,42.86 6.51,40.64 8.89,40.64
  pour Top: 24.45,42.86 24.45,40.64 26.67,40.64 26.67,42.86
  pour Top (isolate 0.406): 32.23,44.61 74.77,44.61 74.77,0.32 42.23,0.32 42.23,18.1 38.89,18.1 38.89,36.2 32.23,36.2
  pour Top: 32.23,27.15 35.24,27.15 35.24,28.26 36.67,28.26 36.67,24.45 35.24,24.45 35.24,25.88 32.23,25.88
  pour Top: 36.51,17.46 32.07,17.46 32.07,19.84 34.13,19.84 34.13,18.73 36.51,18.73
INT_REF
  Top 0.254: U4.3 45.38,40.94 46.35,41.91 REF_SEL.3
LOOP_FILTER_IN
  Top 0.254: C3.1 C2.1 42.55,26.41 R2.2 42.55,26.61 42.55,27.15 43.02,27.62 46.35,27.62 48.6,29.86 U1.P$7
LOOP_FILTER_OUT  (via drill 0.3)
  Top 0.254: C1.1 44.45,26.41 R2.1 v46.04,26.51 | U1.P$20 54.99,30.86 v55.4,31.27
  Bottom 0.254: v55.4,31.27 55.4,29.37 52.55,26.51 v46.04,26.51
N$1
  Top 0.254: U2.P$3 44.84,10.57 44.13,11.27 44.13,15.72 46.35,17.94 49.69,17.94 52.39,20.64 C5.2
N$2
  Top 0.254: U2.P$4 44.38,10.07 43.5,10.95 43.5,16.03 46.04,18.57 48.74,18.57 50.64,20.48 C4.2
N$3
  Top 0.254: U1.P$29 51.19,36.39 C7.2
N$4
  Top 0.406: TR2.4 68.76,8.18
  Top 1.016: 68.76,8.18 L9.1
N$5
  Top 0.254: U2.P$16 55.49,10.57 55.72,10.79 56.52,10.79 56.67,10.95 56.67,11.32 C42.1 L7.2
N$6
  Top 0.254: U1.P$22 54.73,31.86 56.04,33.18 R1.2
N$7
  Top 0.254: U2.P$15 55.49,10.07 55.72,9.84 56.36,9.84 56.52,9.68 56.52,9.48 C43.1 L8.2
N$8
  Top 0.254: C2.2 42.55,21.53 R3.1
N$9
  Top 0.254: L2.2 C5.1 52.39,23.97 51.69,24.67 U1.P$13
N$10
  Top 0.254: L1.2 C4.1 50.64,24.13 51.19,24.67 U1.P$12
N$11
  Top 1.016: U5.1 20,39.05 18.22,40.83 C39.+
  Bottom 1.016: 6-12V_DC.P$2 11.43,33.02 12.54,31.91 17.94,31.91 20,33.97 U5.1
N$12
  Top 0.254: 59.17,8.82 C43.2 | TR2.3 60.87,8.18 60.8,8.26
  Top 0.406: 60.8,8.26 60.33,8.26 59.85,8.73 59.26,8.73 59.17,8.82
N$13
  Top 0.254: 57.11,29.89 56.15,29.89 55.68,30.36 U1.P$19 | 57.11,29.89 59.79,29.89 60.17,30.27 60.17,31.06 C13.1 | 57.11,29.89 57.11,31.09 C12.1
N$14
  Top 0.254: U1.P$23 54.27,32.37 56.2,34.29 C9.1 C8.1
N$15
  Top 0.254: U3.24 10.37,8.46 9.84,7.94 PIC_GPIO.5
N$16
  Top 0.254: 59.17,11.82 C42.2
  Top 0.406: TR2.1 59.03,11.18 C42.2
N$17
  Top 0.254: U3.23 7.07,9.12 5.71,10.48 PIC_GPIO.4
N$18
  Top 0.254: U1.P$14 52.19,27.35 56.52,23.02 C20.1 L3.2
N$19  (via drill 0.3)
  Top 0.254: U3.9 18.16,11.05 v17.62,11.59
  Bottom 0.254: v17.62,11.59 14.29,11.59 12.38,13.49 12.38,25.88 15.08,28.57 17.62,28.57 PIC_REF.2
N$20
  Top 0.254: U1.P$24 54.61,33.71 C10.1 C11.1
N$21
  Top 0.254: U1.P$15 52.69,27.96 55.88,24.77 C21.1 L4.2
N$22
  Top 0.254: 24.93,9.93 L5.1 | 24.85,9.86 L5.1 | U3.13 22.68,13.67 24.97,11.39 L5.1
N$23
  Top 0.254: TR1.1 60.87,25.31 60.33,24.77 C21.2
N$24
  Top 0.254: L6.1 28.12,9.97 L5.2 C23.2
N$25
  Top 0.254: TR1.3 61.03,22.31 60.33,23.02 C20.2
N$26
  Top 0.406: 71.12,22.54 arc10 69.06,22.38 arc-10 TR1.4
  Top 1.016: RF_OUT_B.SIG 71.12,22.54
N$27
  Top 0.254: C37.1 47.47,6.83 48.76,8.12 U2.P$7
N$28
  Top 0.254: U3.22 8.66,9.76 5.4,13.02 PIC_GPIO.3
N$29
  Top 0.254: U3.21 10.38,10.42 5.24,15.56 PIC_GPIO.2
N$31
  Top 0.254: R6.1 R7.2 48.76,13.46 U2.P$24
N$32
  Top 0.406: 62.39,39.69 arc-60 66.99,37.15 arc60 70.96,34.92
  Top 1.016: C45.1 62.39,39.69 | 70.96,34.92 arc-2 REF_IN.SIG
N$37
  Top 0.254: C31.1 50.96,6.83 49.76,8.03 U2.P$9
N$38
  Top 0.254: U2.P$8 49.26,6.94 49.21,6.83 C32.1
N$40
  Top 0.406: RF_OUT_A.SIG 68.95,10
  Top 1.016: 68.95,10 L9.2 C44.1
PIC_MCLR
  Top 0.254: U3.1 19.82,4.95 20.22,4.54 PIC_PROG.P$1
PIC_PGC
  Top 0.254: U3.27 11.27,6.51 10.79,6.03 10.79,4.65 PIC_PROG.P$5
PIC_PGD
  Top 0.254: U3.28 12.55,4.89 PIC_PROG.P$4
REF_OSC
  Top 0.254: C7.1 REF_SEL.2
  Bottom 0.254: PIC_REF.1 33.5,38.58 36.51,41.59 45.72,41.59 47.15,40.16 50.64,40.16 51.12,40.64 REF_SEL.2
UART_RX
  Top 0.254: PIC_UART.3 5.4,22.7 7.3,20.8 7.3,15.72 10.64,12.37 U3.18
UART_TX
  Top 0.254: U3.17 11.12,13.01 8.26,15.88 8.26,22.54 5.56,25.24 PIC_UART.2
VCC  (via drill 0.3, 0.5)
  Top 0.254: U1.P$32 49.69,33.98 v49.69,34.61 47.09,34.61 C28.1 C29.1 44.35,34.55 v44.29,34.61 | U1.P$26 52.69,34.15 v52.23,34.61 51.69,34.06 U1.P$28 | 16.67,16.19 16.67,16.35 16.73,16.41 C22.1
  Top 0.305: PIC_PROG.P$2 18.22,4.64 16.03,6.83 16.03,9.68 14.66,11.05 | 16.67,16.35 16.67,13.06 14.66,11.05 | U3.20 14.66,11.05
  Top 0.406: C22.1 16.67,16.51 v16.67,18.1 | v35.72,35.08 35.72,29.97 C48.1
  Top 0.61: C48.1 34.4,29.79 33.66,29.05 U6.2
  Top 1.016: 33.1,28.99 U6.2
  Route3 0.254: v49.69,34.61 v52.23,34.61
  Route3 0.406: v16.67,18.1 13.97,20.8 13.97,23.81 16.83,26.67 21.27,26.67 29.69,35.08 v35.72,35.08 42.7,35.08 43.18,34.61 v44.29,34.61
VDD  (via drill 0.3, 0.5)
  Top 0.254: C40.1 C38.1 | U1.P$16 53.77,28.79 | U1.P$17 53.77,28.79 | U1.P$6 48.3,30.36 47.47,29.53 45.8,29.53 C18.1 45.39,29.83 45.09,29.53 44.04,29.53 C19.1 43.63,29.82 43.34,29.53 42.39,29.53 v42.07,29.21 | v61.12,29.37 59.53,29.37 | 59.53,29.37 57.15,29.37 56.73,28.95 C51.1 55.77,28.9 55.77,28.79 53.77,28.79 | 48.9,21.43 L1.1 C27.1 v47.15,20.16 | 54.24,21.27 L2.1 54.13,19.63 C26.1 v52.7,19.53 | U1.P$10 50.19,27.57 C6.1 C17.1 48.26,28.41 v48.42,28.57 | L3.1 C54.1 C55.1 61.12,19.47 v61.12,20.95 | U4.4 37.5,40.94 C40.1 | C40.1 37.36,38.95 v37.31,38.89 | L4.1 C46.1 | 59.59,28.37 C46.1 | 59.53,29.37 59.53,28.31 C46.1
  Route3 0.254: v37.31,38.89 37.31,38.58
  other vias: 37.47,22.23 37.47,20.95
  pour Route3: 45.56,27.46 45.56,18.89 42.7,16.03 38.1,16.03 38.1,22.7 36.99,22.7 36.99,14.92 43.34,14.92 47.47,19.05 60.33,19.05 62.55,21.27 62.55,33.97 57.15,39.37 36.83,39.37 36.83,38.42 50.01,38.42 53.66,34.45 53.66,30.64 49.05,30.64 46.51,28.1 42.55,28.1 42.55,29.53 41.59,29.53 41.59,27.46
  pour Top: 32.86,20.95 35.4,20.95 35.4,19.84 38.1,19.84 38.1,23.18 35.4,23.18 35.4,21.91 32.86,21.91

### Text on the board
_tsilk: INT_REF | EXT_REF | - | + | GND | TX | RX | GND | RB0 | RB3 | LA1K CW beacon project | LA {7VRA, 1BFA, 3JPA} | Design: LA3JPA - 2012